# Altium schematic sheet Schematic.SchDoc
size 381 x 241 mm; SheetNumber: 1; SheetTotal: 1
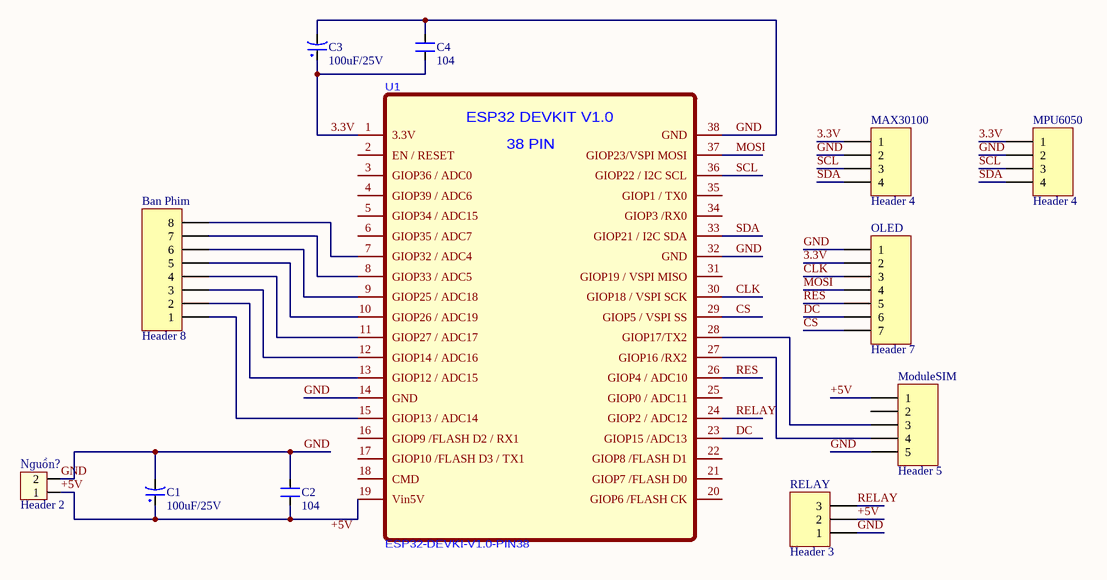
[diagram p0: Schematic.SchDoc]

## Parts
Ban_Phim  Header 8  [HDR1X8]
C1  100uF/25V  [CP1.5/3.4]
C2  104  [CN1]
C3  100uF/25V  [CP1.5/3.4]
C4  104  [CN1]
MAX30100  Header 4  [HDR1X4]
ModuleSIM  Header 5  [HDR1X5]
MPU6050  Header 4  [HDR1X4]
Nguồn?  Header 2  [HED2]
OLED  Header 7  [HDR1X7]
RELAY  Header 3  [HDR1X3]
U1  ESP32-DEVKI-V1.0-PIN38  [ESP32-DEVKIT-V1.0-38PIN]

## Nets
3.3V: C3.1 C4.2 MAX30100.1 MPU6050.1 OLED.2 U1.1(3.3V)
+5V: C1.1 C2.2 ModuleSIM.1 Nguồn?.1 RELAY.2 U1.19(Vin5V)
CLK: OLED.3 U1.30(GIOP18_/_VSPI_SCK)
CS: OLED.7 U1.29(GIOP5_/_VSPI_SS)
DC: OLED.6 U1.23(GIOP15_/ADC13)
GND: C1.2 C2.1 C3.2 C4.1 MAX30100.2 ModuleSIM.5 MPU6050.2 Nguồn?.2 OLED.1 RELAY.1 U1.14(GND) U1.32(GND) U1.38(GND)
MOSI: OLED.4 U1.37(GIOP23/VSPI_MOSI)
RELAY: RELAY.3 U1.24(GIOP2_/_ADC12)
RES: OLED.5 U1.26(GIOP4_/_ADC10)
SCL: MAX30100.3 MPU6050.3 U1.36(GIOP22_/_I2C_SCL)
SDA: MAX30100.4 MPU6050.4 U1.33(GIOP21_/_I2C_SDA)
NetBan_Phim_1: Ban_Phim.1 U1.15(GIOP13_/_ADC14)
NetBan_Phim_2: Ban_Phim.2 U1.13(GIOP12_/_ADC15)
NetBan_Phim_3: Ban_Phim.3 U1.12(GIOP14_/_ADC16)
NetBan_Phim_4: Ban_Phim.4 U1.11(GIOP27_/_ADC17)
NetBan_Phim_5: Ban_Phim.5 U1.10(GIOP26_/_ADC19)
NetBan_Phim_6: Ban_Phim.6 U1.9(GIOP25_/_ADC18)
NetBan_Phim_7: Ban_Phim.7 U1.8(GIOP33_/_ADC5)
NetBan_Phim_8: Ban_Phim.8 U1.7(GIOP32_/_ADC4)
NetModuleSIM_3: ModuleSIM.3 U1.28(GIOP17/TX2)
NetModuleSIM_4: ModuleSIM.4 U1.27(GIOP16_/RX2)

Not connected (* = marked no-connect by the designer): ModuleSIM 2; U1 2(EN_/_RESET) 3(GIOP36_/_ADC0) 4(GIOP39_/_ADC6) 5(GIOP34_/_ADC15) 6(GIOP35_/_ADC7) 16(GIOP9_/FLASH_D2_/_RX1) 17(GIOP10_/FLASH_D3_/_TX1) 18(CMD) 20(GIOP6_/FLASH_CK) 21(GIOP7_/FLASH_D0) 22(GIOP8_/FLASH_D1) 25(GIOP0_/_ADC11) 31(GIOP19_/_VSPI_MISO) 34(GIOP3_/RX0) 35(GIOP1_/_TX0)

## Notes on the sheet
- Labels drawn without touching a wire or pin: +5V
- (in symbol ESP32-DEVKI-V1.0-PIN38) ESP32 DEVKIT V1.0; 38 PIN

## Library data of the parts
Ban_Phim = Header 8: Header, 8-Pin; LatestRevisionDate: 17-Jul-2002; LatestRevisionNote: Re-released for DXP Platform.; Publisher: Altium Limited
C1 C3 = CP3: Cap 100uF/35V - 470uF/16V; Value: 100uF/35V/50V; Description 1: 1000uF/6,3V - 470uF/16V - 330uF - 25V; Description 2: 220uF/35V - 100uF/50V - 63V - 4,7uF/200V; Description 3: 22uF => 33uF100V - 3,3uF => 4,7uF/250V; Description 4: 2,2uF =>3,3uF/350 - 2,2uF/400V - 1uF/450V
C2 C4 = CN1: Cap np  1pF - 472pF; Value: 100pF
MAX30100 MPU6050 = Header 4: Header, 4-Pin; LatestRevisionDate: 17-Jul-2002; LatestRevisionNote: Re-released for DXP Platform.; Publisher: Altium Limited
ModuleSIM = Header 5: Header, 5-Pin; LatestRevisionDate: 17-Jul-2002; LatestRevisionNote: Re-released for DXP Platform.; Publisher: Altium Limited
Nguồn? = Hed2: Header 2 (Green); Value: Header 2
OLED = Header 7: Header, 7-Pin; LatestRevisionDate: 17-Jul-2002; LatestRevisionNote: Re-released for DXP Platform.; Publisher: Altium Limited
RELAY = Header 3: Header, 3-Pin; LatestRevisionDate: 17-Jul-2002; LatestRevisionNote: Re-released for DXP Platform.; Publisher: Altium Limited